# EAGLE design FSR Platform (EAGLE 9.0.1)
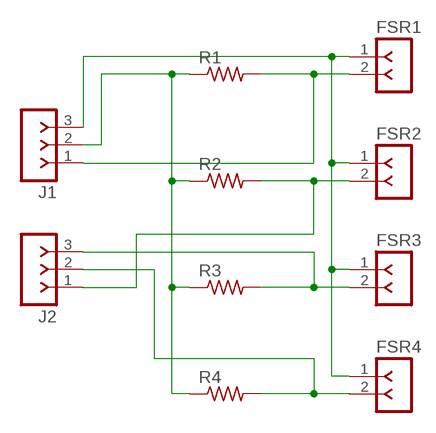
[diagram p0: schematic, sheet 1]

## Parts
FSR1  FSR-5''  [FSR-5'']
FSR2  FSR-5''  [FSR-5'']
FSR3  FSR-5''  [FSR-5'']
FSR4  FSR-5''  [FSR-5'']
J1  F-1X03-SIP-100-40  [SIP-100-03-40]
J2  F-1X03-SIP-100-40  [SIP-100-03-40]
R1  RESISTOR_R-US_0204/5  [RESISTOR_0204/5]
R2  RESISTOR_R-US_0204/5  [RESISTOR_0204/5]
R3  RESISTOR_R-US_0204/5  [RESISTOR_0204/5]
R4  RESISTOR_R-US_0204/5  [RESISTOR_0204/5]

## Nets
COM0: J1.2 R1.1 R2.1 R3.1 R4.1
COM1: FSR1.1 FSR2.1 FSR3.1 FSR4.1 J1.3
N$1: FSR1.2 J1.1 R1.2
N$2: FSR2.2 J2.1 R2.2
N$3: FSR3.2 J2.3 R3.2
N$4: FSR4.2 J2.2 R4.2

## Library data of the parts
FSR1-FSR4 = MMC Eagle:FSR-5''
J1 J2 = MMC Eagle:F-1X03-: FEMALE HEADER
R1-R4 = MMC Eagle:RESISTOR_R-US_: RESISTOR, American symbol

## Net classes
0 default: width 0.305 mm, drill 0.356 mm, clearance 0.254 mm

## Board
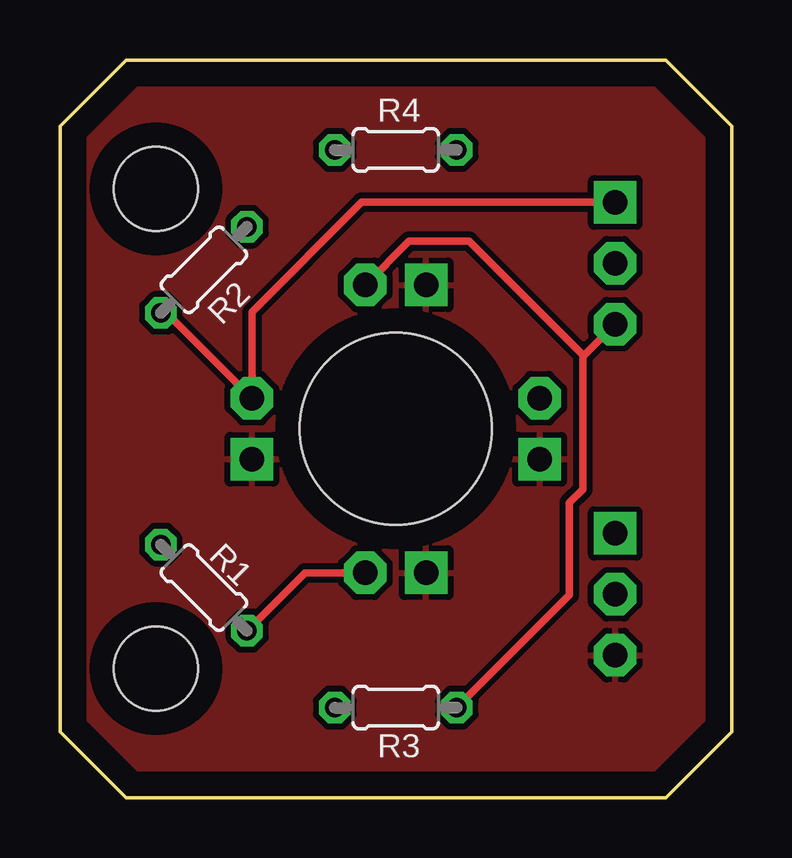
[diagram p1: board, top side]
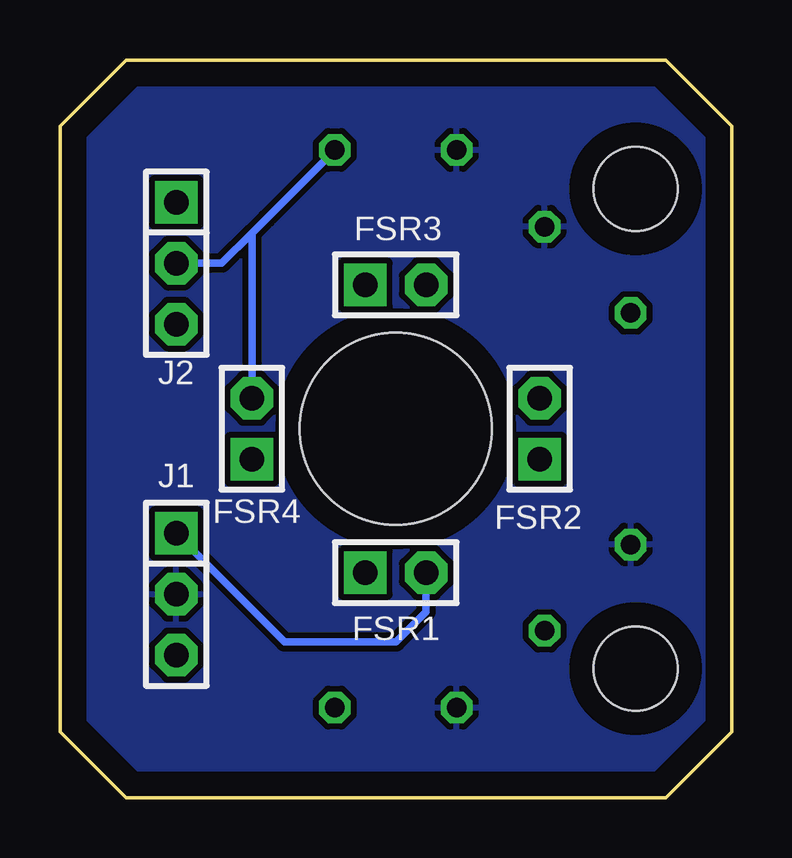
[diagram p2: board, bottom side, seen from below]

Size 28 x 30.75 mm. Coordinates in mm from the lower left corner, seen from the top.
Outline: 2.75,0 25.25,0 28,2.75 28,28 25.25,30.75 2.75,30.75 0,28 0,2.75 2.75,0
Copper layers (1*16): Top 0.035mm / dielectric 1.5mm / Bottom 0.035mm
Design rules "default": minimum track width 6mil, minimum drill 0.35mm, track to track 6mil, track to pad 6mil, pad to pad 6mil, via to via 6mil, smd to smd 6mil, copper to edge 40mil, drill to drill 6mil, minimum pad ring 10mil, minimum via ring 8mil, stop-mask expansion 4mil, vias tented up to drill 0mil, thermal gap 10mil
Holes 3.5 mm at 4,5.38 4,25.38
Holes 8 mm at 14,15.38

### Footprints (pad centres in the part's own frame; a part is rotated, then mirrored left to right if it is on the bottom)
FSR-5'' = drill 1.016 pad 1.778 square: 1 -1.27,0 | drill 1.016 pad 1.778 octagon: 2 1.27,0
SIP-100-03-40 = drill 1.016 pad 1.778 square: 1 -2.54,0 | drill 1.016 pad 1.778 octagon: 2 0,0; 3 2.54,0
RESISTOR_0204/5 = drill 0.813 octagon: 1 -2.54,0; 2 2.54,0

### Placement (x,y rotation side)
FSR1  14,9.38 0 bottom
FSR2  8,15.38 90 bottom
FSR3  14,21.38 0 bottom
FSR4  20,15.38 90 bottom
J1  23.15,8.47 270 bottom
J2  23.15,22.27 270 bottom
R1  6,8.75 315 top
R2  6,22 225 top
R3  14,3.75 0 top
R4  14,27 0 top

### Tracks (layer width: path | path; a pad name or v marks a point on that pad's centre or on a via)
COM0
  pour Bottom: 28,0 0,0 0,31.75 28,31.75
COM1
  pour Top: 0,0 28,0 28,30.75 0,30.75
N$1
  Top 0.305: R1.2 10.22,9.38 FSR1.2
  Bottom 0.305: FSR1.2 12.75,9.36 12.75,7.75 14,6.5 18.64,6.5 J1.1
N$2
  Top 0.305: J2.1 12.56,24.82 8,20.25 FSR2.2 4.44,20.2 R2.2
N$3
  Top 0.305: 21.79,18.38 21.79,18.44 17.04,23.19 14.54,23.19 FSR3.2 | 21.79,18.38 21.79,12.85 21.23,12.29 21.23,8.44 R3.2 | J2.3 21.79,18.38
N$4
  Bottom 0.305: R4.2 19.39,24.14 20,23.54 | 20,23.54 21.27,22.27 J2.2 | FSR4.2 20,23.54